# Altium schematic sheet Sheet1.SchDoc
size A4
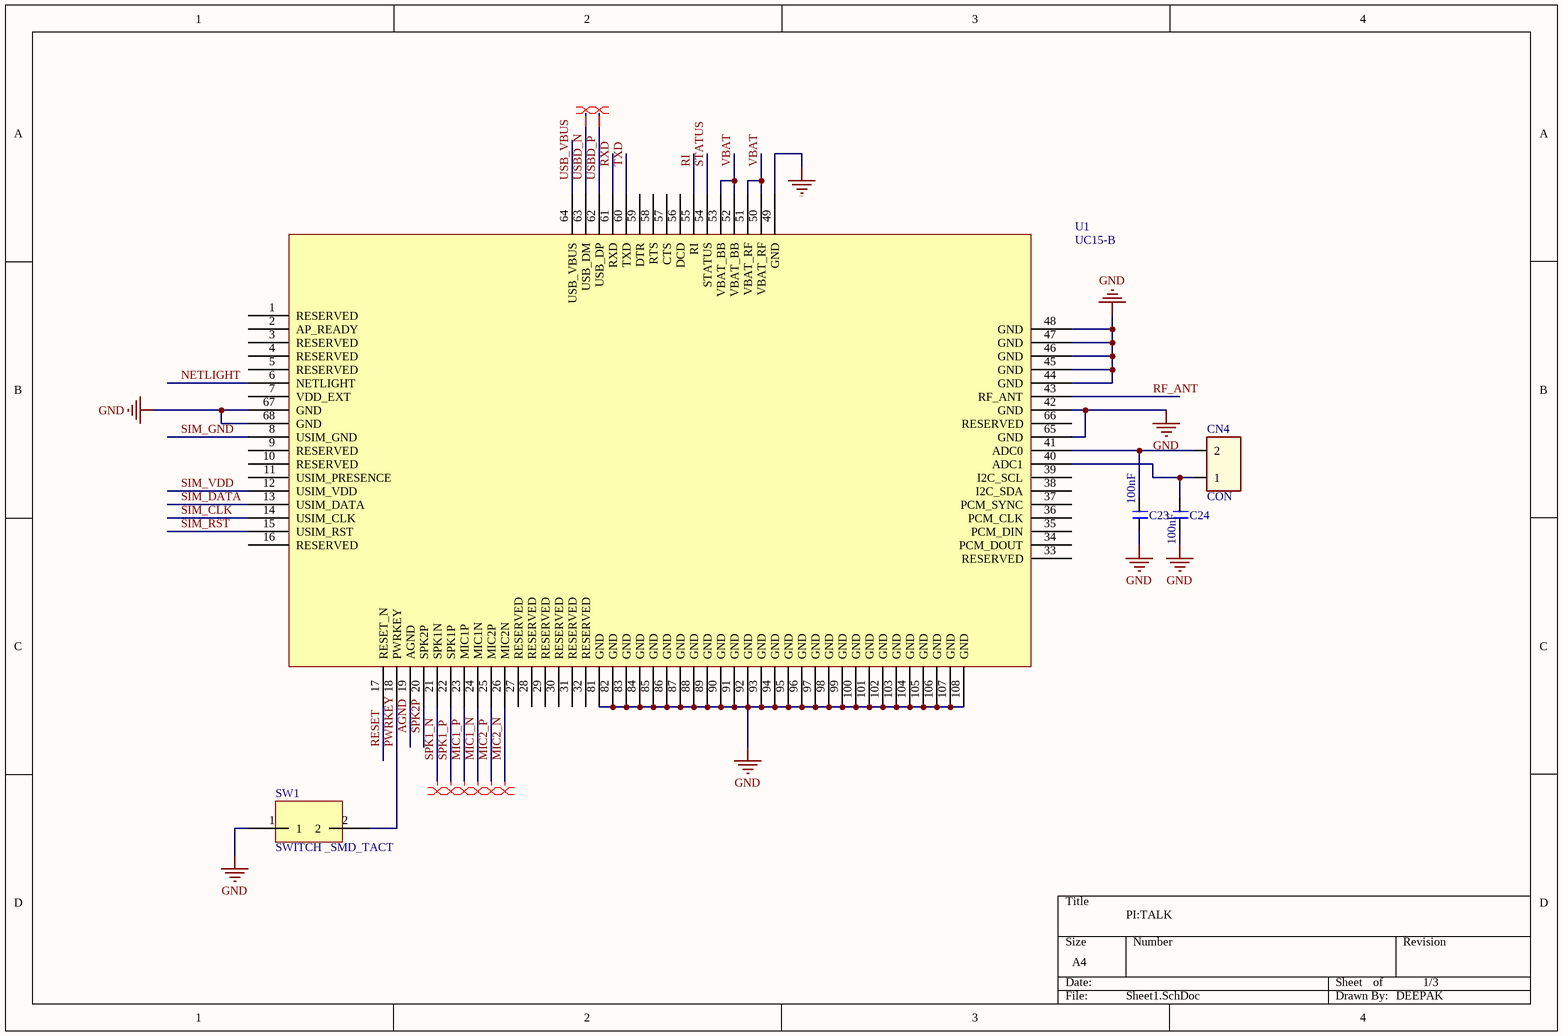
[diagram p0: Sheet1.SchDoc]

## Parts
C23  100nF  [CAP_0603_NONPOLAR]
C24  100nF  [CAP_0603_NONPOLAR]
CN4  CON  [CON2_BJ]
SW1  SWITCH _SMD_TACT  [SWITCH_SMD]
U1  UC15-B  [UC15_B]

## Nets
GND: C23.1 C24.1 SW1.1 U1.42(GND) U1.44(GND) U1.45(GND) U1.46(GND) U1.47(GND) U1.48(GND) U1.49(GND) U1.65(GND) U1.67(GND) U1.68(GND) U1.81(GND) U1.82(GND) U1.83(GND) U1.84(GND) U1.85(GND) U1.86(GND) U1.87(GND) U1.88(GND) U1.89(GND) U1.90(GND) U1.91(GND) U1.92(GND) U1.93(GND) U1.94(GND) U1.95(GND) U1.96(GND) U1.97(GND) U1.98(GND) U1.99(GND) U1.100(GND) U1.101(GND) U1.102(GND) U1.103(GND) U1.104(GND) U1.105(GND) U1.106(GND) U1.107(GND) U1.108(GND)
AGND: U1.19(AGND)
MIC1_N: U1.24(MIC1N)
MIC1_P: U1.23(MIC1P)
MIC2_N: U1.26(MIC2N)
MIC2_P: U1.25(MIC2P)
NETLIGHT: U1.6(NETLIGHT)
PWRKEY: SW1.2 U1.18(PWRKEY)
RESET: U1.17(RESET_N)
RF_ANT: U1.43(RF_ANT)
RI: U1.55(RI)
RXD: U1.61(RXD)
SIM_CLK: U1.14(USIM_CLK)
SIM_DATA: U1.13(USIM_DATA)
SIM_GND: U1.8(USIM_GND)
SIM_RST: U1.15(USIM_RST)
SIM_VDD: U1.12(USIM_VDD)
SPK1_N: U1.21(SPK1N)
SPK1_P: U1.22(SPK1P)
SPK2P: U1.20(SPK2P)
STATUS: U1.54(STATUS)
TXD: U1.60(TXD)
USB_VBUS: U1.64(USB_VBUS)
USBD_N: U1.63(USB_DM)
USBD_P: U1.62(USB_DP)
VBAT: U1.50(VBAT_RF) U1.51(VBAT_RF) U1.52(VBAT_BB) U1.53(VBAT_BB)
NetC23_2: C23.2 CN4.2 U1.41(ADC0)
NetC24_2: C24.2 CN4.1 U1.40(ADC1)

Not connected (* = marked no-connect by the designer): U1 1(RESERVED) 2(AP_READY) 3(RESERVED) 4(RESERVED) 5(RESERVED) 7(VDD_EXT) 9(RESERVED) 10(RESERVED) 11(USIM_PRESENCE) 16(RESERVED) 27(RESERVED) 28(RESERVED) 29(RESERVED) 30(RESERVED) 31(RESERVED) 32(RESERVED) 33(RESERVED) 34(PCM_DOUT) 35(PCM_DIN) 36(PCM_CLK) 37(PCM_SYNC) 38(I2C_SDA) 39(I2C_SCL) 56(DCD) 57(CTS) 58(RTS) 59(DTR) 66(RESERVED)

## Layout directives
differential pair: MIC1_N, MIC1_P, MIC2_N, MIC2_P, SPK1_N, SPK1_P, USBD_N, USBD_P

## Notes on the sheet
- PI:TALK
- 1/3
- DEEPAK

## Library data of the parts
C23 C24 = CAP_NONPOLAR
CN4 = CON2
U1 = UC15